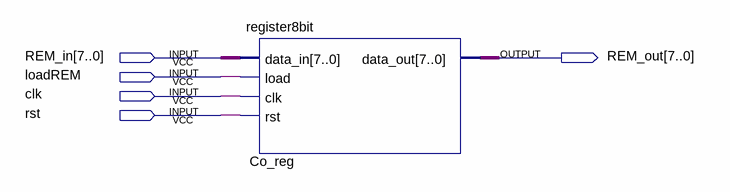
[diagram p0: schematic sheet]
// Quartus schematic regREM.bdf as structural Verilog: 1 symbols, 5 pins
module regREM (
  input  [7:0] REM_in,
  input  loadREM,
  input  clk,
  input  rst,
  output [7:0] REM_out
);

  register8bit Co_reg (.data_in(REM_in), .load(loadREM), .clk(clk), .rst(rst), .data_out(REM_out));
endmodule
